# EAGLE design eib-128 (EAGLE 6.5.0)
DESIGNER: JONNEW, MWL@MIT; DESIGN_NAME: eib-128 (2x64_hirose-circular); LICENSE: (c) Jon Newman CC-BY-SA-NC 4.0; REVISION: 1.1
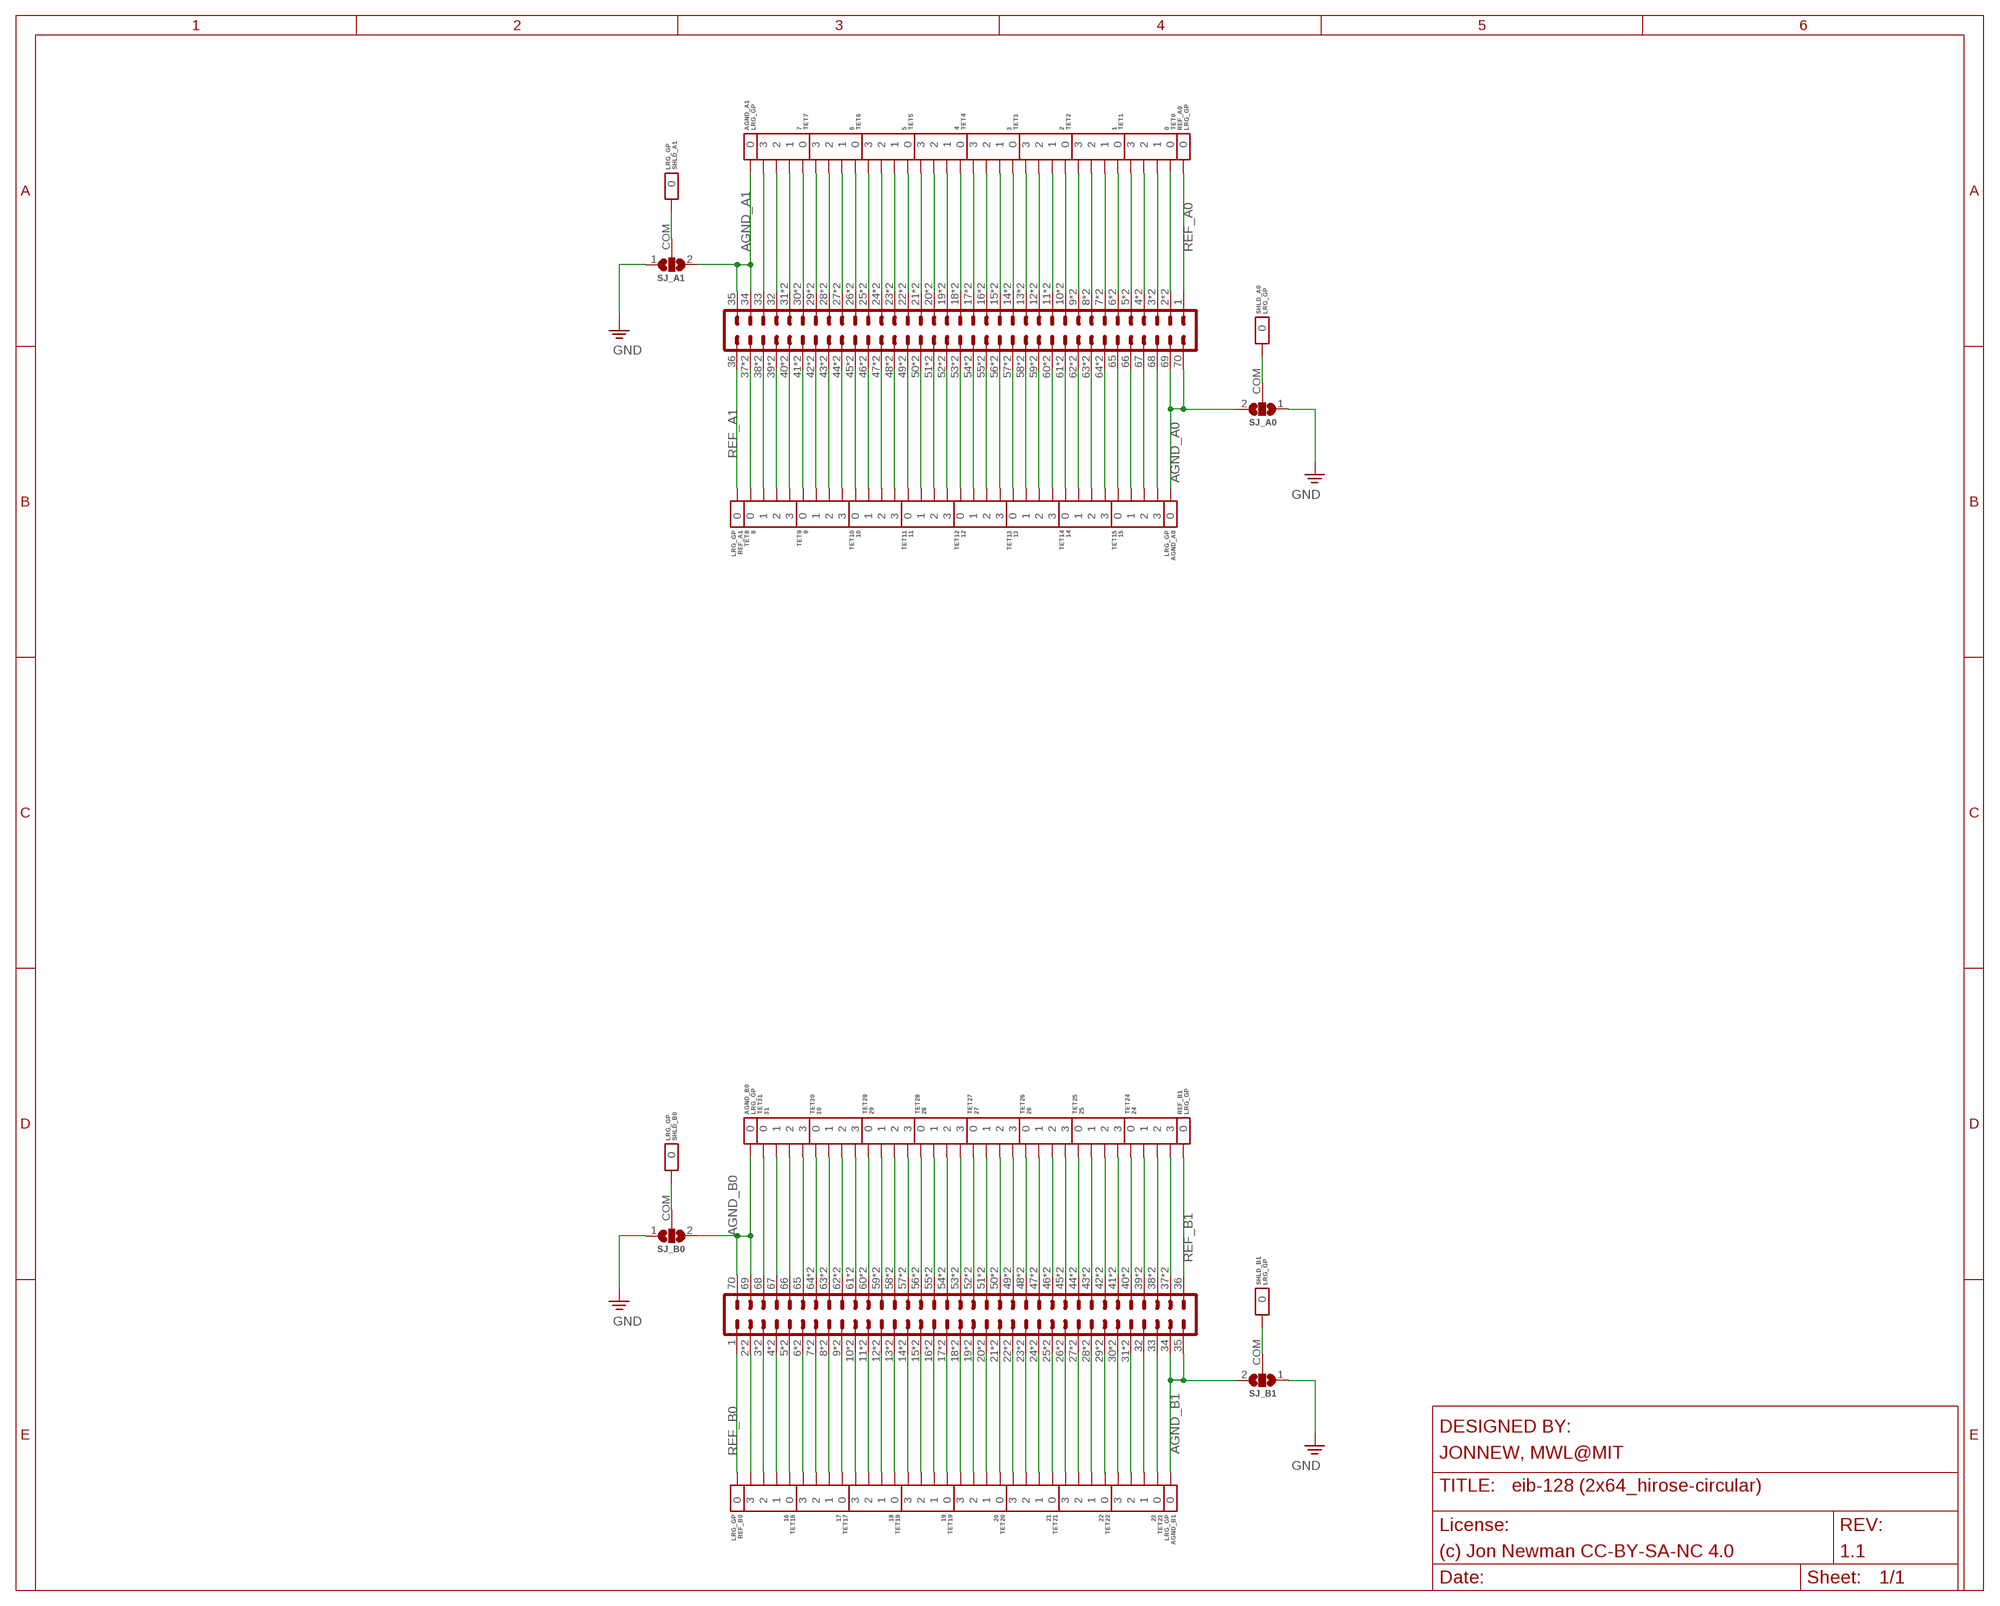
[diagram p0: schematic, sheet 1]

## Parts
AGND_A0  LRG_GP  GOLDPIN_0.5ID_0.7OD  [GOLDPIN_0.5ID_0.7OD]
AGND_A1  LRG_GP  GOLDPIN_0.5ID_0.7OD  [GOLDPIN_0.5ID_0.7OD]
AGND_B0  LRG_GP  GOLDPIN_0.5ID_0.7OD  [GOLDPIN_0.5ID_0.7OD]
AGND_B1  LRG_GP  GOLDPIN_0.5ID_0.7OD  [GOLDPIN_0.5ID_0.7OD]
AIN_N0T  DF40HEAD  PINHD-2X35_DF40HEAD-EIB  [DF40-70HEAD-EIB]
AIN_S0T  DF40HEAD  PINHD-2X35_DF40HEAD-EIB  [DF40-70HEAD-EIB]
REF_A0  LRG_GP  GOLDPIN_0.5ID_0.7OD  [GOLDPIN_0.5ID_0.7OD]
REF_A1  LRG_GP  GOLDPIN_0.5ID_0.7OD  [GOLDPIN_0.5ID_0.7OD]
REF_B0  LRG_GP  GOLDPIN_0.5ID_0.7OD  [GOLDPIN_0.5ID_0.7OD]
REF_B1  LRG_GP  GOLDPIN_0.5ID_0.7OD  [GOLDPIN_0.5ID_0.7OD]
SHLD_A0  LRG_GP  GOLDPIN_0.5ID_0.7OD  [GOLDPIN_0.5ID_0.7OD]
SHLD_A1  LRG_GP  GOLDPIN_0.5ID_0.7OD  [GOLDPIN_0.5ID_0.7OD]
SHLD_B0  LRG_GP  GOLDPIN_0.5ID_0.7OD  [GOLDPIN_0.5ID_0.7OD]
SHLD_B1  LRG_GP  GOLDPIN_0.5ID_0.7OD  [GOLDPIN_0.5ID_0.7OD]
SJ_A0  SJ2_0402  [SJ_2_0402]
SJ_A1  SJ2_0402  [SJ_2_0402]
SJ_B0  SJ2_0402  [SJ_2_0402]
SJ_B1  SJ2_0402  [SJ_2_0402]
TET0  0  TETRODE_128_0.5ID_0.7OD  [TETRODE_128_0.5ID_0.7OD]
TET1  1  TETRODE_128_0.5ID_0.7OD  [TETRODE_128_0.5ID_0.7OD]
TET2  2  TETRODE_128_0.5ID_0.7OD  [TETRODE_128_0.5ID_0.7OD]
TET3  3  TETRODE_128_0.5ID_0.7OD  [TETRODE_128_0.5ID_0.7OD]
TET4  4  TETRODE_128_0.5ID_0.7OD  [TETRODE_128_0.5ID_0.7OD]
TET5  5  TETRODE_128_0.5ID_0.7OD  [TETRODE_128_0.5ID_0.7OD]
TET6  6  TETRODE_128_0.5ID_0.7OD  [TETRODE_128_0.5ID_0.7OD]
TET7  7  TETRODE_128_0.5ID_0.7OD  [TETRODE_128_0.5ID_0.7OD]
TET8  8  TETRODE_128_0.5ID_0.7OD  [TETRODE_128_0.5ID_0.7OD]
TET9  9  TETRODE_128_0.5ID_0.7OD  [TETRODE_128_0.5ID_0.7OD]
TET10  10  TETRODE_128_0.5ID_0.7OD  [TETRODE_128_0.5ID_0.7OD]
TET11  11  TETRODE_128_0.5ID_0.7OD  [TETRODE_128_0.5ID_0.7OD]
TET12  12  TETRODE_128_0.5ID_0.7OD  [TETRODE_128_0.5ID_0.7OD]
TET13  13  TETRODE_128_0.5ID_0.7OD  [TETRODE_128_0.5ID_0.7OD]
TET14  14  TETRODE_128_0.5ID_0.7OD  [TETRODE_128_0.5ID_0.7OD]
TET15  15  TETRODE_128_0.5ID_0.7OD  [TETRODE_128_0.5ID_0.7OD]
TET16  16  TETRODE_128_0.5ID_0.7OD  [TETRODE_128_0.5ID_0.7OD]
TET17  17  TETRODE_128_0.5ID_0.7OD  [TETRODE_128_0.5ID_0.7OD]
TET18  18  TETRODE_128_0.5ID_0.7OD  [TETRODE_128_0.5ID_0.7OD]
TET19  19  TETRODE_128_0.5ID_0.7OD  [TETRODE_128_0.5ID_0.7OD]
TET20  20  TETRODE_128_0.5ID_0.7OD  [TETRODE_128_0.5ID_0.7OD]
TET21  21  TETRODE_128_0.5ID_0.7OD  [TETRODE_128_0.5ID_0.7OD]
TET22  22  TETRODE_128_0.5ID_0.7OD  [TETRODE_128_0.5ID_0.7OD]
TET23  23  TETRODE_128_0.5ID_0.7OD  [TETRODE_128_0.5ID_0.7OD]
TET24  24  TETRODE_128_0.5ID_0.7OD  [TETRODE_128_0.5ID_0.7OD]
TET25  25  TETRODE_128_0.5ID_0.7OD  [TETRODE_128_0.5ID_0.7OD]
TET26  26  TETRODE_128_0.5ID_0.7OD  [TETRODE_128_0.5ID_0.7OD]
TET27  27  TETRODE_128_0.5ID_0.7OD  [TETRODE_128_0.5ID_0.7OD]
TET28  28  TETRODE_128_0.5ID_0.7OD  [TETRODE_128_0.5ID_0.7OD]
TET29  29  TETRODE_128_0.5ID_0.7OD  [TETRODE_128_0.5ID_0.7OD]
TET30  30  TETRODE_128_0.5ID_0.7OD  [TETRODE_128_0.5ID_0.7OD]
TET31  31  TETRODE_128_0.5ID_0.7OD  [TETRODE_128_0.5ID_0.7OD]

## Nets
AGND_A0: AGND_A0.P$1 AIN_N0T.69 AIN_N0T.70 SJ_A0.2
AGND_A1: AGND_A1.P$1 AIN_N0T.34 AIN_N0T.35 SJ_A1.2
AGND_B0: AGND_B0.P$1 AIN_S0T.69 AIN_S0T.70 SJ_B0.2
AGND_B1: AGND_B1.P$1 AIN_S0T.34 AIN_S0T.35 SJ_B1.2
GND: SJ_A0.1 SJ_A1.1 SJ_B0.1 SJ_B1.1
N$1: SHLD_A0.P$1 SJ_A0.COM
N$2: SHLD_A1.P$1 SJ_A1.COM
N$3: SHLD_B0.P$1 SJ_B0.COM
N$4: SHLD_B1.P$1 SJ_B1.COM
N$65: AIN_S0T.33 TET23.0
N$66: AIN_S0T.32 TET23.1
N$67: AIN_S0T.31 AIN_S0T.P31 TET23.2
N$68: AIN_S0T.30 AIN_S0T.P30 TET23.3
N$69: AIN_S0T.29 AIN_S0T.P29 TET22.0
N$70: AIN_S0T.28 AIN_S0T.P28 TET22.1
N$71: AIN_S0T.27 AIN_S0T.P27 TET22.2
N$72: AIN_S0T.26 AIN_S0T.P26 TET22.3
N$73: AIN_S0T.25 AIN_S0T.P25 TET21.0
N$74: AIN_S0T.24 AIN_S0T.P24 TET21.1
N$75: AIN_S0T.23 AIN_S0T.P23 TET21.2
N$76: AIN_S0T.22 AIN_S0T.P22 TET21.3
N$77: AIN_S0T.21 AIN_S0T.P21 TET20.0
N$78: AIN_S0T.20 AIN_S0T.P20 TET20.1
N$79: AIN_S0T.19 AIN_S0T.P19 TET20.2
N$80: AIN_S0T.18 AIN_S0T.P18 TET20.3
N$81: AIN_S0T.17 AIN_S0T.P17 TET19.0
N$82: AIN_S0T.16 AIN_S0T.P16 TET19.1
N$83: AIN_S0T.15 AIN_S0T.P15 TET19.2
N$84: AIN_S0T.14 AIN_S0T.P14 TET19.3
N$85: AIN_S0T.13 AIN_S0T.P13 TET18.0
N$86: AIN_S0T.12 AIN_S0T.P12 TET18.1
N$87: AIN_S0T.11 AIN_S0T.P11 TET18.2
N$88: AIN_S0T.10 AIN_S0T.P10 TET18.3
N$89: AIN_S0T.9 AIN_S0T.P9 TET17.0
N$90: AIN_S0T.8 AIN_S0T.P8 TET17.1
N$91: AIN_S0T.7 AIN_S0T.P7 TET17.2
N$92: AIN_S0T.6 AIN_S0T.P6 TET17.3
N$93: AIN_S0T.5 AIN_S0T.P5 TET16.0
N$94: AIN_S0T.4 AIN_S0T.P4 TET16.1
N$95: AIN_S0T.3 AIN_S0T.P3 TET16.2
N$96: AIN_S0T.38 AIN_S0T.P38 TET24.2
N$97: AIN_S0T.39 AIN_S0T.P39 TET24.1
N$98: AIN_S0T.40 AIN_S0T.P40 TET24.0
N$99: AIN_S0T.41 AIN_S0T.P41 TET25.3
N$100: AIN_S0T.42 AIN_S0T.P42 TET25.2
N$101: AIN_S0T.43 AIN_S0T.P43 TET25.1
N$102: AIN_S0T.44 AIN_S0T.P44 TET25.0
N$103: AIN_S0T.45 AIN_S0T.P45 TET26.3
N$104: AIN_S0T.46 AIN_S0T.P46 TET26.2
N$105: AIN_S0T.47 AIN_S0T.P47 TET26.1
N$106: AIN_S0T.48 AIN_S0T.P48 TET26.0
N$107: AIN_S0T.49 AIN_S0T.P49 TET27.3
N$108: AIN_S0T.50 AIN_S0T.P50 TET27.2
N$109: AIN_S0T.51 AIN_S0T.P51 TET27.1
N$110: AIN_S0T.52 AIN_S0T.P52 TET27.0
N$111: AIN_S0T.53 AIN_S0T.P53 TET28.3
N$112: AIN_S0T.54 AIN_S0T.P54 TET28.2
N$113: AIN_S0T.55 AIN_S0T.P55 TET28.1
N$114: AIN_S0T.56 AIN_S0T.P56 TET28.0
N$115: AIN_S0T.57 AIN_S0T.P57 TET29.3
N$116: AIN_S0T.58 AIN_S0T.P58 TET29.2
N$117: AIN_S0T.59 AIN_S0T.P59 TET29.1
N$118: AIN_S0T.60 AIN_S0T.P60 TET29.0
N$119: AIN_S0T.61 AIN_S0T.P61 TET30.3
N$120: AIN_S0T.62 AIN_S0T.P62 TET30.2
N$121: AIN_S0T.63 AIN_S0T.P63 TET30.1
N$122: AIN_S0T.64 AIN_S0T.P64 TET30.0
N$123: AIN_S0T.65 TET31.3
N$124: AIN_S0T.66 TET31.2
N$125: AIN_S0T.67 TET31.1
N$126: AIN_S0T.68 TET31.0
N$127: AIN_S0T.2 AIN_S0T.P2 TET16.3
N$128: AIN_S0T.37 AIN_S0T.P37 TET24.3
N$199: AIN_N0T.33 TET7.3
N$200: AIN_N0T.32 TET7.2
N$201: AIN_N0T.31 AIN_N0T.P31 TET7.1
N$202: AIN_N0T.30 AIN_N0T.P30 TET7.0
N$203: AIN_N0T.29 AIN_N0T.P29 TET6.3
N$204: AIN_N0T.28 AIN_N0T.P28 TET6.2
N$205: AIN_N0T.27 AIN_N0T.P27 TET6.1
N$206: AIN_N0T.26 AIN_N0T.P26 TET6.0
N$207: AIN_N0T.25 AIN_N0T.P25 TET5.3
N$208: AIN_N0T.24 AIN_N0T.P24 TET5.2
N$209: AIN_N0T.23 AIN_N0T.P23 TET5.1
N$210: AIN_N0T.22 AIN_N0T.P22 TET5.0
N$211: AIN_N0T.21 AIN_N0T.P21 TET4.3
N$212: AIN_N0T.20 AIN_N0T.P20 TET4.2
N$213: AIN_N0T.19 AIN_N0T.P19 TET4.1
N$214: AIN_N0T.18 AIN_N0T.P18 TET4.0
N$215: AIN_N0T.17 AIN_N0T.P17 TET3.3
N$216: AIN_N0T.16 AIN_N0T.P16 TET3.2
N$217: AIN_N0T.15 AIN_N0T.P15 TET3.1
N$218: AIN_N0T.14 AIN_N0T.P14 TET3.0
N$219: AIN_N0T.13 AIN_N0T.P13 TET2.3
N$220: AIN_N0T.12 AIN_N0T.P12 TET2.2
N$221: AIN_N0T.11 AIN_N0T.P11 TET2.1
N$222: AIN_N0T.10 AIN_N0T.P10 TET2.0
N$223: AIN_N0T.9 AIN_N0T.P9 TET1.3
N$224: AIN_N0T.8 AIN_N0T.P8 TET1.2
N$225: AIN_N0T.7 AIN_N0T.P7 TET1.1
N$226: AIN_N0T.6 AIN_N0T.P6 TET1.0
N$227: AIN_N0T.5 AIN_N0T.P5 TET0.3
N$228: AIN_N0T.4 AIN_N0T.P4 TET0.2
N$229: AIN_N0T.3 AIN_N0T.P3 TET0.1
N$230: AIN_N0T.2 AIN_N0T.P2 TET0.0
N$231: AIN_N0T.38 AIN_N0T.P38 TET8.1
N$232: AIN_N0T.39 AIN_N0T.P39 TET8.2
N$233: AIN_N0T.40 AIN_N0T.P40 TET8.3
N$234: AIN_N0T.41 AIN_N0T.P41 TET9.0
N$235: AIN_N0T.42 AIN_N0T.P42 TET9.1
N$236: AIN_N0T.43 AIN_N0T.P43 TET9.2
N$237: AIN_N0T.44 AIN_N0T.P44 TET9.3
N$238: AIN_N0T.45 AIN_N0T.P45 TET10.0
N$239: AIN_N0T.46 AIN_N0T.P46 TET10.1
N$240: AIN_N0T.47 AIN_N0T.P47 TET10.2
N$241: AIN_N0T.48 AIN_N0T.P48 TET10.3
N$242: AIN_N0T.49 AIN_N0T.P49 TET11.0
N$243: AIN_N0T.50 AIN_N0T.P50 TET11.1
N$244: AIN_N0T.51 AIN_N0T.P51 TET11.2
N$245: AIN_N0T.52 AIN_N0T.P52 TET11.3
N$246: AIN_N0T.53 AIN_N0T.P53 TET12.0
N$247: AIN_N0T.54 AIN_N0T.P54 TET12.1
N$248: AIN_N0T.55 AIN_N0T.P55 TET12.2
N$249: AIN_N0T.56 AIN_N0T.P56 TET12.3
N$250: AIN_N0T.57 AIN_N0T.P57 TET13.0
N$251: AIN_N0T.58 AIN_N0T.P58 TET13.1
N$252: AIN_N0T.59 AIN_N0T.P59 TET13.2
N$253: AIN_N0T.60 AIN_N0T.P60 TET13.3
N$254: AIN_N0T.61 AIN_N0T.P61 TET14.0
N$255: AIN_N0T.62 AIN_N0T.P62 TET14.1
N$256: AIN_N0T.63 AIN_N0T.P63 TET14.2
N$257: AIN_N0T.64 AIN_N0T.P64 TET14.3
N$258: AIN_N0T.65 TET15.0
N$259: AIN_N0T.66 TET15.1
N$260: AIN_N0T.67 TET15.2
N$261: AIN_N0T.68 TET15.3
N$1000: AIN_N0T.37 AIN_N0T.P37 TET8.0
REF_A0: AIN_N0T.1 REF_A0.P$1
REF_A1: AIN_N0T.36 REF_A1.P$1
REF_B0: AIN_S0T.1 REF_B0.P$1
REF_B1: AIN_S0T.36 REF_B1.P$1

## Library data of the parts
AGND_A0 AGND_A1 AGND_B0 AGND_B1 REF_A0 REF_A1 REF_B0 REF_B1 SHLD_A0 SHLD_A1 SHLD_B0 SHLD_B1 = jonnew:GOLDPIN
AIN_N0T AIN_S0T = jonnew:PINHD-2X35
SJ_A0 SJ_A1 SJ_B0 SJ_B1 = jonnew:SJ2: SMD solder JUMPER
TET0 TET1-TET31 = jonnew:TETRODE

## Net classes
1 thick: width 0.102 mm

## Board
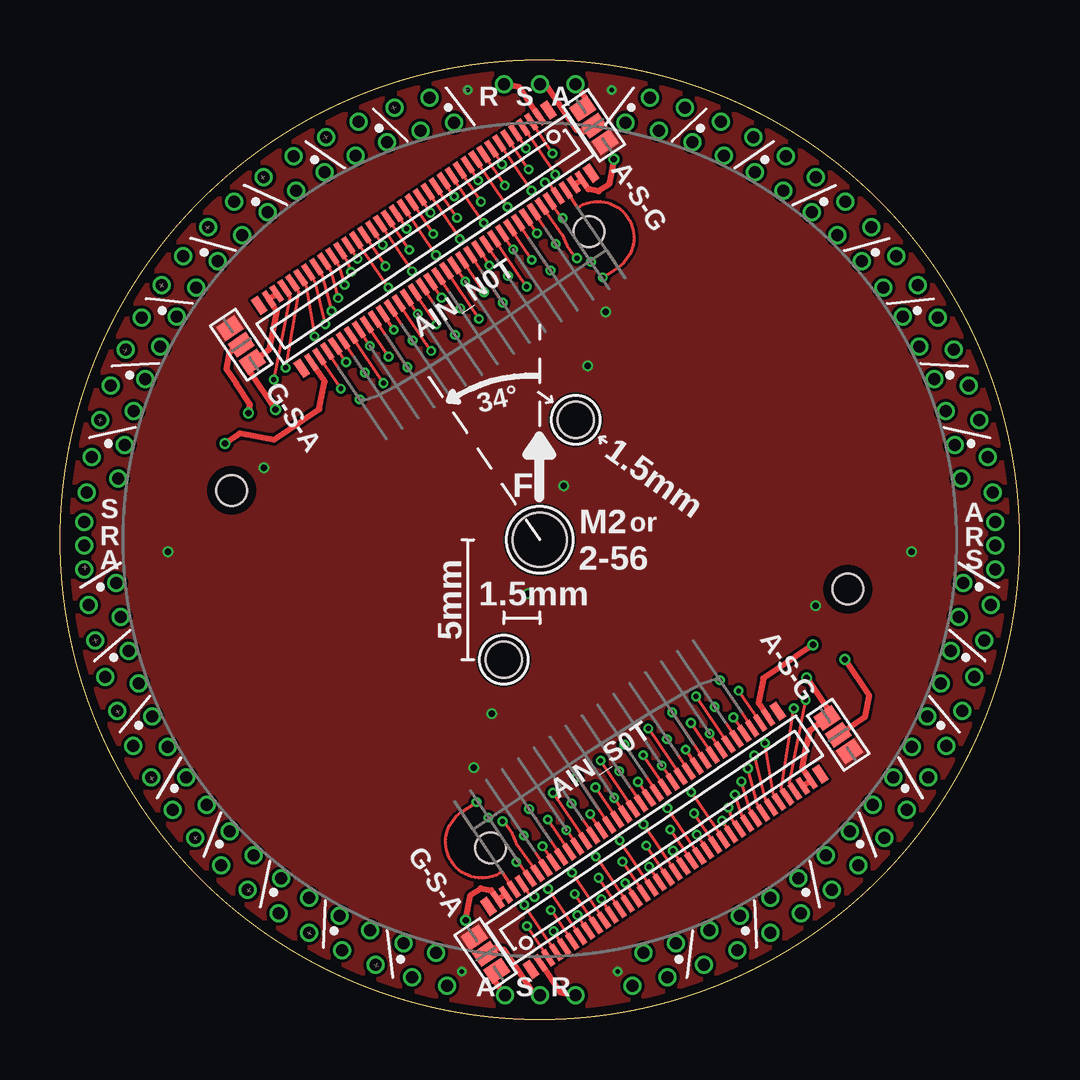
[diagram p1: board, top side]
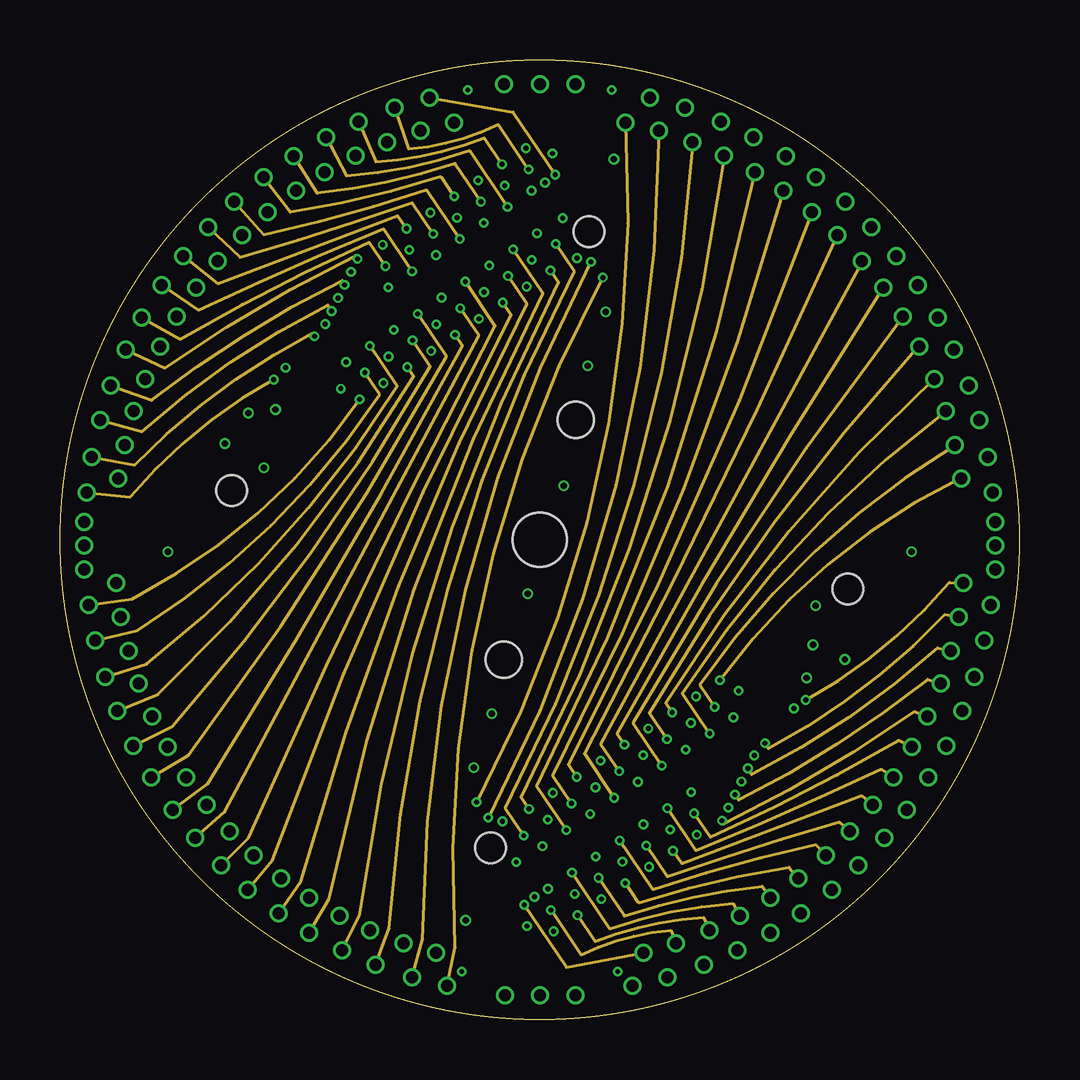
[diagram p2: board, inner layer Route2]
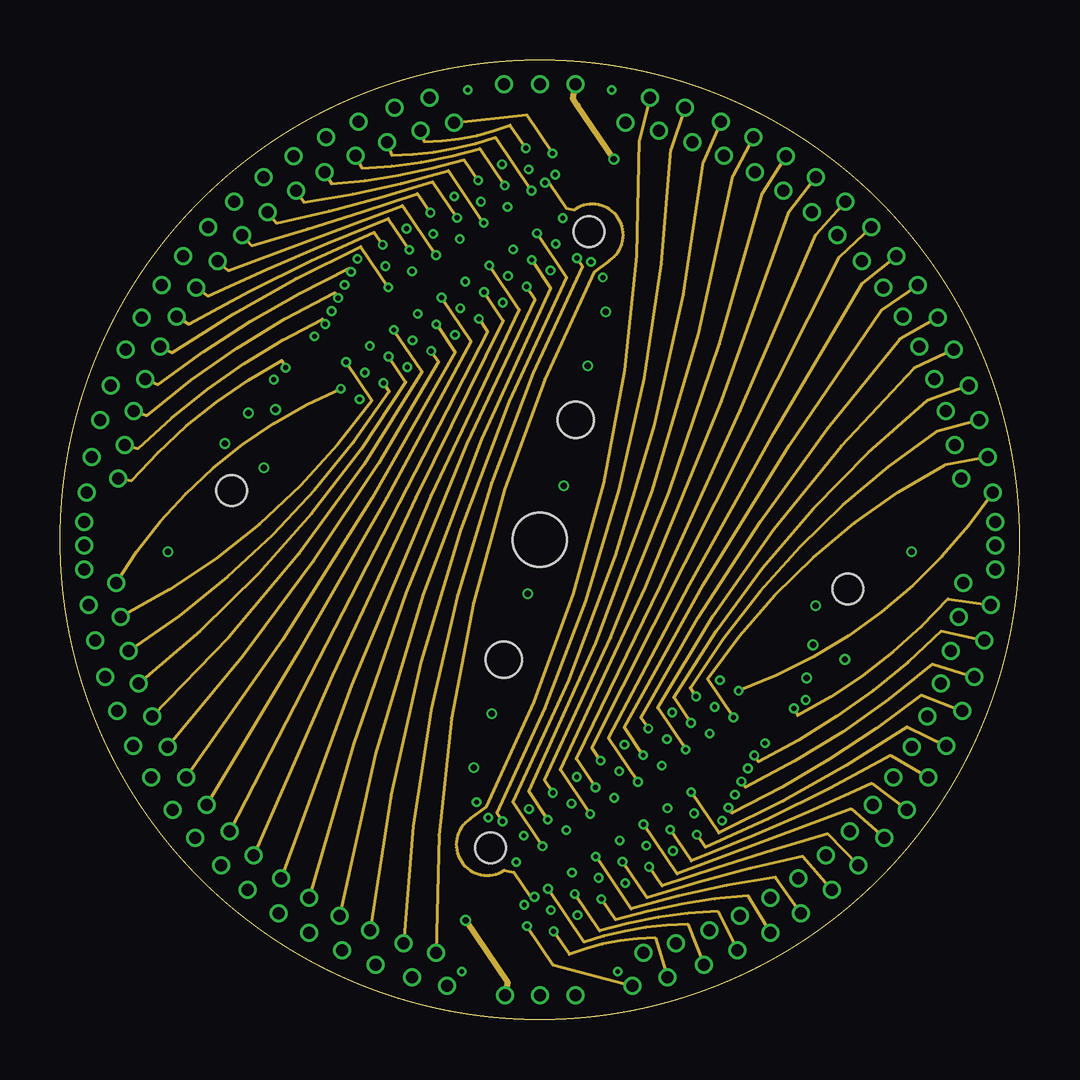
[diagram p3: board, inner layer Route15]
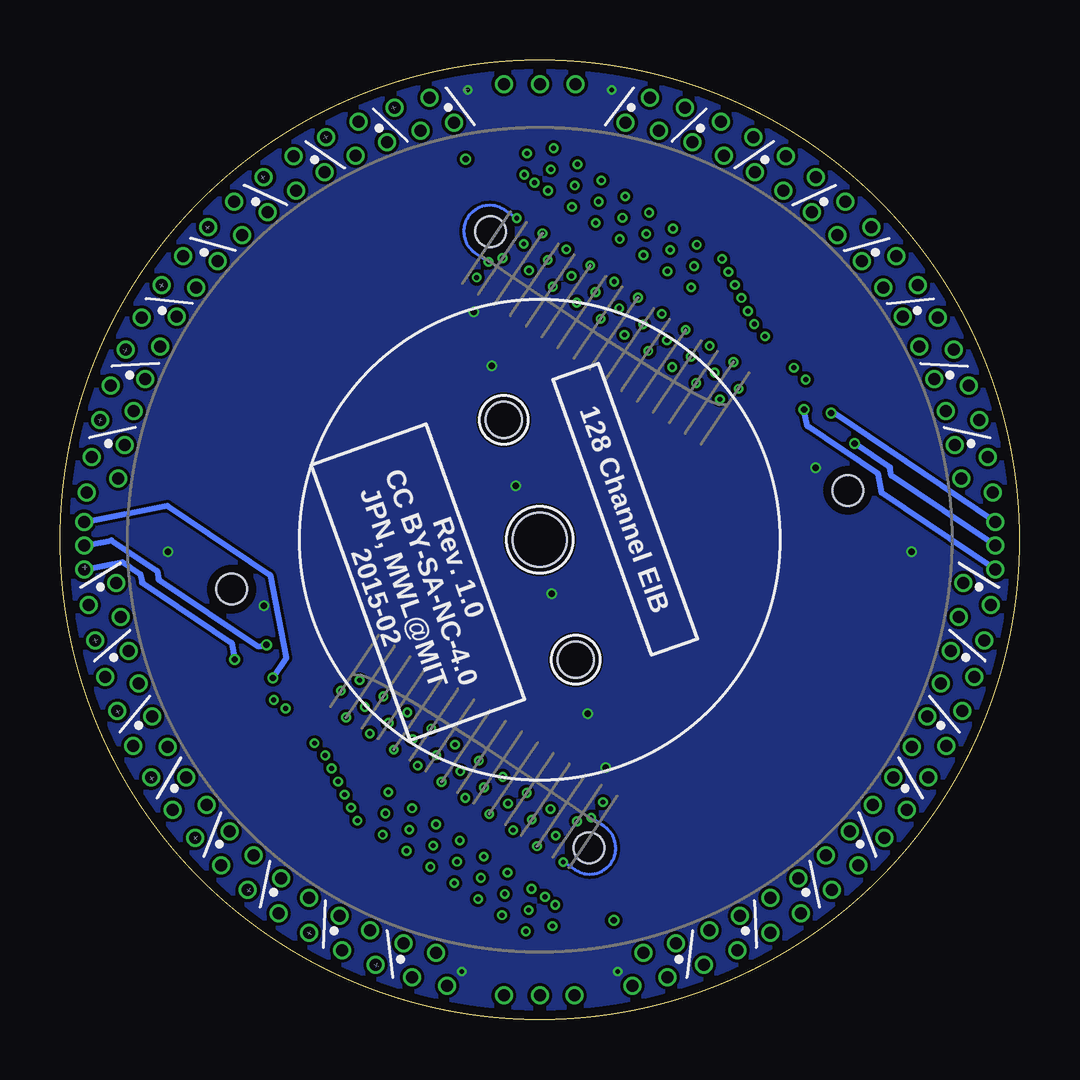
[diagram p4: board, bottom side, seen from below]

Size 40 x 40 mm. Coordinates in mm from the lower left corner, seen from the top.
Outline: circle at 20,20 radius 20
Outline: circle at 20,20 radius 20
Copper layers (1*2*15*16): Top 0.035559375mm / dielectric 0.17018125mm / Route2 0.01778125mm / dielectric 47mil / Route15 0.01778125mm / dielectric 0.17018125mm / Bottom 0.035559375mm
Design rules "sierra-circuits-advanced *": minimum track width 5mil, minimum drill 0.000196875mm, track to track 5mil, track to pad 5mil, pad to pad 5mil, via to via 5mil, smd to smd 5mil, copper to edge 15mil, drill to drill 5mil, minimum pad ring 4mil, minimum via ring 4mil, stop-mask expansion 4mil, vias tented up to drill 100mil, thermal gap 10mil
Holes 1.27 mm at 22.06,32.85 32.85,17.94 17.94,7.15 7.15,22.06

### Footprints (pad centres in the part's own frame; a part is rotated, then mirrored left to right if it is on the bottom)
GOLDPIN_0.5ID_0.7OD = drill 0.5 pad 0.7: P$1 0,0
DF40-70HEAD-EIB = smd 0.23 x 0.75: 1 -6.8,-1.585; 2 -6.4,-1.585; 3 -6,-1.585; 4 -5.6,-1.585; 5 -5.2,-1.585; 6 -4.8,-1.585; 7 -4.4,-1.585; 8 -4,-1.585; 9 -3.6,-1.585; 10 -3.2,-1.585; 11 -2.8,-1.585; 12 -2.4,-1.585; 13 -2,-1.585; 14 -1.6,-1.585; 15 -1.2,-1.585; 16 -0.8,-1.585; 17 -0.4,-1.585; 18 0,-1.585; 19 0.4,-1.585; 20 0.8,-1.585; 21 1.2,-1.585; 22 1.6,-1.585; 23 2,-1.585; 24 2.4,-1.585; 25 2.8,-1.585; 26 3.2,-1.585; 27 3.6,-1.585; 28 4,-1.585; 29 4.4,-1.585; 30 4.8,-1.585; 31 5.2,-1.585; 32 5.6,-1.585; 33 6,-1.585; 34 6.4,-1.585; 35 6.8,-1.585; 36 6.8,1.585; 37 6.4,1.585; 38 6,1.585; 39 5.6,1.585; 40 5.2,1.585; 41 4.8,1.585; 42 4.4,1.585; 43 4,1.585; 44 3.6,1.585; 45 3.2,1.585; 46 2.8,1.585; 47 2.4,1.585; 48 2,1.585; 49 1.6,1.585; 50 1.2,1.585; 51 0.8,1.585; 52 0.4,1.585; 53 0,1.585; 54 -0.4,1.585; 55 -0.8,1.585; 56 -1.2,1.585; 57 -1.6,1.585; 58 -2,1.585; 59 -2.4,1.585; 60 -2.8,1.585; 61 -3.2,1.585; 62 -3.6,1.585; 63 -4,1.585; 64 -4.4,1.585; 65 -4.8,1.585; 66 -5.2,1.585; 67 -5.6,1.585; 68 -6,1.585; 69 -6.4,1.585; 70 -6.8,1.585 | smd 0.35 x 0.75: M1 -7.275,-1.585; M2 7.275,-1.585; M3 7.275,1.585; M4 -7.275,1.585 | drill 0.2 pad 0.305: P2 -6.4,0; P3 -6,0.8; P4 -5.6,-0.8; P5 -5.2,0; P6 -4.8,0.8; P7 -4.4,-0.8; P8 -4,0; P9 -3.6,0.8; P10 -3.2,-0.8; P11 -2.8,0; P12 -2.4,0.8; P13 -2,-0.8; P14 -1.6,0; P15 -1.2,0.8; P16 -0.8,-0.8; P17 -0.4,0; P18 0,0.8; P19 0.4,-0.8; P20 0.8,0; P21 1.2,0.8; P22 1.6,-0.8; P23 2,0; P24 2.4,0.8; P25 2.8,-0.9; P26 3.327,-0.6; P27 3.854,-0.3; P28 4.381,0; P29 4.908,0.3; P30 5.435,0.6; P31 6.089,0.773; P37 6.4,3.2; P38 6,4; P39 5.6,2.4; P40 5.2,3.2; P41 4.8,4; P42 4.4,2.4; P43 4,3.2; P44 3.6,4; P45 3.2,2.4; P46 2.8,3.2; P47 2.4,4; P48 2,2.4; P49 1.6,3.2; P50 1.2,4; P51 0.8,2.4; P52 0.4,3.2; P53 0,4; P54 -0.4,2.4; P55 -0.8,3.2; P56 -1.2,4; P57 -1.6,2.4; P58 -2,3.2; P59 -2.4,4; P60 -2.8,2.4; P61 -3.2,3.2; P62 -3.6,4; P63 -4,2.4; P64 -4.4,3.2
SJ_2_0402 = smd 0.7 x 0.9: 1 -0.838,0; 2 0.838,0; COM 0,0
TETRODE_128_0.5ID_0.7OD = drill 0.5 pad 0.703: 0 0.724,17.743; 1 1.562,18.934; 2 2.14,17.628; 3 3.058,18.748
EIB_MOUNT_A = hole 2.261: 0,0 | hole 1.5: 1.5,5; -1.5,-5

### Placement (x,y rotation side)
AGND_A0  21.5,39 0 top
AGND_A1  1,18.75 0 top
AGND_B0  18.55,1 34 top
AGND_B1  39,20.75 34 top
AIN_N0T  15.23,32.53 214 top
AIN_S0T  24.77,7.47 34 top
REF_A0  18.5,39 0 top
REF_A1  1,19.75 0 top
REF_B0  21.5,1 34 top
REF_B1  39,19.75 34 top
SHLD_A0  20,39 0 top
SHLD_A1  1,20.75 0 top
SHLD_B0  20,1 34 top
SHLD_B1  39,18.75 34 top
SJ_A0  22.26,37.27 124 top
SJ_A1  7.55,28.13 304 top
SJ_B0  17.74,2.73 304 top
SJ_B1  32.45,11.87 124 top
TET0  20,20 350.7 bottom
TET1  20,20 341.3 bottom
TET2  20,20 332 bottom
TET3  20,20 322.6 bottom
TET4  20,20 313.2 bottom
TET5  20,20 303.9 bottom
TET6  20,20 294.5 bottom
TET7  20,20 285.2 bottom
TET8  20,20 266.5 bottom
TET9  20,20 257.2 bottom
TET10  20,20 247.8 bottom
TET11  20,20 238.4 bottom
TET12  20,20 229.1 bottom
TET13  20,20 219.7 bottom
TET14  20,20 210.4 bottom
TET15  20,20 201 bottom
TET16  20,20 201 top
TET17  20,20 210.4 top
TET18  20,20 219.7 top
TET19  20,20 229.1 top
TET20  20,20 238.4 top
TET21  20,20 247.8 top
TET22  20,20 257.2 top
TET23  20,20 266.5 top
TET24  20,20 285.2 top
TET25  20,20 294.5 top
TET26  20,20 303.9 top
TET27  20,20 313.2 top
TET28  20,20 322.6 top
TET29  20,20 332 top
TET30  20,20 341.3 top
TET31  20,20 350.7 top
U$1  [EIB_MOUNT_A]  20,20 0 top

### Tracks (layer width: path | path; a pad name or v marks a point on that pad's centre or on a via)
AGND_A0  (via drill 0.25)
  Top 0.254: AIN_N0T.69 AIN_N0T.70 22.02,34.61 22.46,34.53 22.88,34.81 v23.08,35.87 | AGND_A0.P$1 21.89,38.42 SJ_A0.2
  Route15 0.254: v23.08,35.87 21.58,38.1 21.38,38.39 AGND_A0.P$1
AGND_A1  (via drill 0.25)
  Top 0.254: AIN_N0T.34 AIN_N0T.35 9.04,29.53 8.74,27.95 SJ_A1.2 7.92,27.01 v8.98,25.43
  Bottom 0.254: AGND_A1.P$1 5.74,21.95 5.9,22.74 8.84,24.73 v8.98,25.43
AGND_B0  (via drill 0.25)
  Top 0.254: AIN_S0T.69 AIN_S0T.70 17.98,5.39 17.54,5.47 17.12,5.19 v16.92,4.13 | AGND_B0.P$1 18.12,1.64 SJ_B0.2
  Route15 0.254: v16.92,4.13 18.66,1.55 AGND_B0.P$1
AGND_B1  (via drill 0.25)
  Top 0.254: v31.12,14.24 32.05,12.86 SJ_B1.2 31.24,12.04 31.12,11.43 30.94,10.49 31.35,9.88 AIN_S0T.35 AIN_S0T.34
  Bottom 0.254: AGND_B1.P$1 35.52,21.43 31.24,18.54 30.57,15.07 v31.12,14.24
GND  (via drill 0.2 pad 0.3, 0.25 pad 0.3)
  other vias: 18,12.75 8.5,23 19.5,17.75 16.75,2 4.5,19.5 23.25,2 21,22.25 22,27.25 35.5,19.5 17,38.75 23,38.75 31.5,17.25 22.75,29.5 17.25,10.5
  pour Top (no thermals): 13.15,-15.26 -15.26,26.85 26.85,55.26 55.26,13.15
  pour Bottom (no thermals): 13.15,-15.26 -15.26,26.85 26.85,55.26 55.26,13.15
N$1
  Top 0.254: SJ_A0.COM 21.88,37.02 21.53,37.09 20.27,38.95 SHLD_A0.P$1
N$2  (via drill 0.25)
  Top 0.254: v7.85,25.29 7.92,25.64 7.36,26.48 | SJ_A1.COM 7.06,27.8 6.93,27.12 7.36,26.48 | 7.36,26.48
  Bottom 0.254: SHLD_A1.P$1 7.76,25.31 v7.85,25.29
N$3
  Top 0.254: SJ_B0.COM 18.12,2.98 18.51,2.91 19.76,1.05 SHLD_B0.P$1
N$4  (via drill 0.25)
  Top 0.254: SJ_B1.COM 33.57,12.63 33.74,13.49 v32.72,15.01
  Bottom 0.254: SHLD_B1.P$1 37.39,19.06 36.65,18.57 36.58,18.22 32.85,15.7 v32.72,15.01
N$65  (via drill 0.2 pad 0.3)
  Top 0.127: AIN_S0T.33 30.41,9.84 v31.09,13.32
  Route2 0.127: v31.09,13.32 arc21 37.08,18.22 TET23.0
N$66  (via drill 0.2 pad 0.3)
  Top 0.127: AIN_S0T.32 30.07,9.63 30.08,9.64 v30.59,12.97
  Route15 0.127: TET23.1 37.01,17.54 arc-21 30.75,12.67 v30.59,12.97
N$67
  Top 0.127: AIN_S0T.31 29.74,9.41 AIN_S0T.P31
  Route2 0.127: TET23.2 36.89,16.88 arc-18 29.54,11.3 29.53,11.3 AIN_S0T.P31
N$68
  Top 0.127: AIN_S0T.30 29.41,9.19 AIN_S0T.P30
  Route15 0.127: TET23.3 36.74,16.19 arc-18 29.12,10.75 AIN_S0T.P30
N$69
  Top 0.127: AIN_S0T.29 29.07,8.96 AIN_S0T.P29
  Route2 0.127: TET22.0 36.57,15.49 arc-15 28.84,10.21 28.84,10.22 AIN_S0T.P29
N$70
  Top 0.127: AIN_S0T.28 28.99,8.4 28.75,8.75 AIN_S0T.P28
  Route15 0.127: TET22.1 36.36,14.82 arc-15 28.56,9.69 AIN_S0T.P28
N$71
  Top 0.127: AIN_S0T.27 28.42,8.52 AIN_S0T.P27
  Route2 0.127: TET22.2 36.17,14.18 arc-12 28.3,9.15 28.29,9.15 AIN_S0T.P27
N$72
  Top 0.127: AIN_S0T.26 28.29,7.93 28.06,8.28 AIN_S0T.P26
  Route15 0.127: TET22.3 35.9,13.52 arc-12 28.02,8.61 AIN_S0T.P26
N$73
  Top 0.127: AIN_S0T.25 AIN_S0T.P25
  Route2 0.127: AIN_S0T.P25 27.69,8.15 27.69,8.15 arc9 35.61,12.84 TET21.0
N$74
  Top 0.127: AIN_S0T.24 AIN_S0T.P24
  Route15 0.127: AIN_S0T.P24 27.47,7.78 arc9 35.32,12.2 TET21.1
N$75
  Top 0.127: AIN_S0T.P23 AIN_S0T.23
  Route2 0.127: AIN_S0T.P23 27.11,7.6 arc6 34.99,11.63 TET21.2
N$76
  Top 0.127: AIN_S0T.22 AIN_S0T.P22
  Route15 0.127: AIN_S0T.P22 26.9,7.18 arc6 34.63,11.01 TET21.3
N$77
  Top 0.127: AIN_S0T.P21 AIN_S0T.21
  Route2 0.127: AIN_S0T.P21 26.52,7.04 arc3 34.25,10.42 TET20.0
N$78
  Top 0.127: AIN_S0T.20 AIN_S0T.P20
  Route15 0.127: AIN_S0T.P20 AIN_S0T.20 arc3 33.84,9.84 TET20.1
N$79
  Top 0.127: AIN_S0T.P19 AIN_S0T.19
  Route2 0.127: AIN_S0T.P19 25.92,6.49 33.44,9.32 TET20.2
N$80
  Top 0.127: AIN_S0T.18 AIN_S0T.P18
  Route15 0.127: AIN_S0T.P18 25.72,6.07 32.98,8.77 TET20.3
N$81
  Top 0.127: AIN_S0T.P17 AIN_S0T.17
  Route2 0.127: AIN_S0T.P17 25.32,5.95 arc-3 32.5,8.23 TET19.0
N$82
  Top 0.127: AIN_S0T.16 AIN_S0T.P16
  Route15 0.127: AIN_S0T.P16 25.09,5.56 arc-3 32.01,7.73 TET19.1
N$83
  Top 0.127: AIN_S0T.P15 AIN_S0T.15
  Route2 0.127: AIN_S0T.P15 24.72,5.41 arc-6 31.52,7.28 TET19.2
N$84
  Top 0.127: AIN_S0T.14 AIN_S0T.P14
  Route15 0.127: AIN_S0T.P14 24.46,5.07 arc-6 30.97,6.79 TET19.3
N$85
  Top 0.127: AIN_S0T.P13 AIN_S0T.13
  Route2 0.127: AIN_S0T.P13 24.12,4.87 arc-9 30.39,6.35 TET18.0
N$86
  Top 0.127: AIN_S0T.12 AIN_S0T.P12
  Route15 0.127: AIN_S0T.P12 23.81,4.61 arc-9 29.83,5.93 TET18.1
N$87
  Top 0.127: AIN_S0T.P11 AIN_S0T.11
  Route2 0.127: AIN_S0T.P11 23.52,4.32 arc-12 29.27,5.56 TET18.2
N$88
  Top 0.127: AIN_S0T.P10 AIN_S0T.10
  Route15 0.127: AIN_S0T.P10 23.15,4.16 arc-12 28.69,5.17 TET18.3
N$89
  Top 0.127: AIN_S0T.9 AIN_S0T.P9
  Route2 0.127: AIN_S0T.P9 22.92,3.79 arc-15 28.05,4.84 TET17.0
N$90
  Top 0.127: AIN_S0T.P8 AIN_S0T.8
  Route15 0.127: AIN_S0T.P8 22.5,3.69 arc-15 27.42,4.51 TET17.1
N$91
  Top 0.127: AIN_S0T.P7 AIN_S0T.7
  Route2 0.127: AIN_S0T.P7 22.31,3.26 arc-18 26.83,4.25 TET17.2
N$92
  Top 0.127: AIN_S0T.6 AIN_S0T.P6
  Route15 0.127: AIN_S0T.P6 21.85,3.22 arc-18 26.17,3.97 TET17.3
N$93
  Top 0.127: AIN_S0T.5 AIN_S0T.P5
  Route2 0.127: AIN_S0T.P5 21.72,2.7 arc-21 25.46,3.72 TET16.0
N$94
  Top 0.127: AIN_S0T.P4 AIN_S0T.4
  Route15 0.127: AIN_S0T.P4 21.23,2.71 arc-21 24.82,3.4 TET16.1
N$95
  Top 0.127: AIN_S0T.P3 AIN_S0T.3
  Route2 0.127: AIN_S0T.P3 21.11,2.17 TET16.2
N$96
  Top 0.127: AIN_S0T.38 AIN_S0T.P38
  Route2 0.127: AIN_S0T.P38 arc-28 37.56,22.57 TET24.2
N$97
  Top 0.127: AIN_S0T.39 AIN_S0T.P39
  Route15 0.127: AIN_S0T.P39 arc90 AIN_S0T.P39 27,14.19 arc-28 36.89,23.12 TET24.1
N$98
  Top 0.127: AIN_S0T.40 AIN_S0T.P40
  Route2 0.127: AIN_S0T.P40 26.68,13.96 arc-24 37.31,23.93 TET24.0
N$99
  Top 0.127: AIN_S0T.41 AIN_S0T.P41
  Route15 0.127: AIN_S0T.P41 arc-90 AIN_S0T.P41 26.27,13.83 arc-24 36.56,24.52 TET25.3
N$100
  Top 0.127: AIN_S0T.42 AIN_S0T.P42
  Route2 0.127: AIN_S0T.P42 25.94,13.6 arc-20 36.91,25.35 TET25.2
N$101
  Top 0.127: AIN_S0T.43 AIN_S0T.P43
  Route15 0.127: AIN_S0T.P43 arc90 AIN_S0T.P43 25.59,13.42 arc-20 36.15,25.81 TET25.1
N$102
  Top 0.127: AIN_S0T.44 AIN_S0T.P44
  Route2 0.127: AIN_S0T.P44 25.26,13.19 arc-16 36.45,26.71 TET25.0
N$103
  Top 0.127: AIN_S0T.45 AIN_S0T.P45
  Route15 0.127: TET26.3 35.61,27.16 arc16 24.92,13 24.92,12.98 AIN_S0T.P45
N$104
  Top 0.127: AIN_S0T.46 AIN_S0T.P46
  Route2 0.127: AIN_S0T.P46 24.57,12.79 arc-12 35.79,28.06 TET26.2
N$105
  Top 0.127: AIN_S0T.47 AIN_S0T.P47
  Route15 0.127: AIN_S0T.P47 arc-90 AIN_S0T.P47 24.22,12.58 arc-12 35,28.37 TET26.1
N$106
  Top 0.127: AIN_S0T.48 AIN_S0T.P48
  Route2 0.127: AIN_S0T.P48 23.89,12.36 arc-8 35.13,29.28 TET26.0
N$107
  Top 0.127: AIN_S0T.49 AIN_S0T.P49
  Route15 0.127: AIN_S0T.P49 arc90 AIN_S0T.P49 | AIN_S0T.P49 23.53,12.18 arc-8 34.25,29.58 TET27.3
N$108
  Top 0.127: AIN_S0T.50 AIN_S0T.P50
  Route2 0.127: AIN_S0T.P50 23.23,11.92 arc-4 34.31,30.5 TET27.2
N$109
  Top 0.127: AIN_S0T.51 AIN_S0T.P51
  Route15 0.127: AIN_S0T.P51 arc-90 AIN_S0T.P51 22.87,11.72 arc-4 33.44,30.69 TET27.1
N$110
  Top 0.127: AIN_S0T.52 AIN_S0T.P52
  Route2 0.127: AIN_S0T.P52 22.54,11.49 TET27.0
N$111
  Top 0.127: AIN_S0T.53 AIN_S0T.P53
  Route15 0.127: AIN_S0T.P53 arc90 AIN_S0T.P53 22.18,11.31 32.48,31.79 TET28.3
N$112
  Top 0.127: AIN_S0T.54 AIN_S0T.P54
  Route2 0.127: AIN_S0T.P54 21.85,11.09 arc4 32.4,32.72 TET28.2
N$113
  Top 0.127: AIN_S0T.55 AIN_S0T.P55
  Route15 0.127: AIN_S0T.P55 arc-90 AIN_S0T.P55 21.52,10.86 arc4 31.51,32.73 TET28.1
N$114
  Top 0.127: AIN_S0T.56 AIN_S0T.P56
  Route2 0.127: AIN_S0T.P56 21.19,10.63 arc8 31.34,33.66 TET28.0
N$115
  Top 0.127: AIN_S0T.P57 22.16,8.47 AIN_S0T.57
  Route15 0.127: AIN_S0T.P57 arc-90 22.1,8.57 20.86,10.4 arc8 30.39,33.66 TET29.3
N$116
  Top 0.127: AIN_S0T.58 AIN_S0T.P58
  Route2 0.127: AIN_S0T.P58 20.53,10.17 arc12 30.17,34.55 TET29.2
N$117
  Top 0.127: AIN_S0T.59 AIN_S0T.P59
  Route15 0.127: AIN_S0T.P59 arc90 AIN_S0T.P59 20.2,9.97 arc12 29.28,34.44 TET29.1
N$118
  Top 0.127: AIN_S0T.60 AIN_S0T.P60
  Route2 0.127: AIN_S0T.P60 19.87,9.74 arc16 TET29.0
N$119
  Top 0.127: AIN_S0T.61 AIN_S0T.P61
  Route15 0.127: AIN_S0T.P61 arc90 AIN_S0T.P61 19.54,9.51 arc16 28.05,35.18 TET30.3
N$120
  Top 0.127: AIN_S0T.62 AIN_S0T.P62
  Route2 0.127: AIN_S0T.P62 19.21,9.28 arc20 27.7,36.01 TET30.2
N$121
  Top 0.127: AIN_S0T.63 AIN_S0T.P63
  Route15 0.127: AIN_S0T.P63 18.88,9.05 arc20 26.83,35.76 TET30.1
N$122
  Top 0.127: AIN_S0T.64 AIN_S0T.P64
  Route2 0.127: AIN_S0T.P64 18.55,8.82 arc24 26.38,36.59 TET30.0
N$123  (via drill 0.2 pad 0.3)
  Top 0.127: AIN_S0T.65 19.85,6.19 19.05,7.29 arc30 v18.45,8.26
  Route15 0.127: v18.45,8.26 arc-90 v18.45,8.26 18.22,8.6 arc24 25.47,36.28 TET31.3
N$124  (via drill 0.2 pad 0.3)
  Top 0.127: 19.51,5.96 AIN_S0T.66 19.13,6.54 v19.02,6.56
  Route2 0.127: TET31.2 24.97,37.03 arc-28 v17.86,8.42 v17.86,8.41
  Bottom 0.127: v19.02,6.56 18.52,6.24 arc-180 17.31,8.04 v17.86,8.41
N$125  (via drill 0.2 pad 0.3)
  Top 0.127: 19.2,5.74 AIN_S0T.67 19.21,5.73 19.6,5.15 v19.78,5.11
  Route15 0.127: 19.6,5.15 v19.78,5.11 19.59,5.15 18.92,6.14 18.51,6.22 arc-180 17.1,8.36 17.77,8.86 arc28 24.15,36.65 TET31.1
N$126  (via drill 0.2 pad 0.3)
  Top 0.127: AIN_S0T.68 18.42,6.16 18.43,6.16 arc-180 16.72,8.63 v17.36,9.06
  Route2 0.127: v17.36,9.06 arc32 TET31.0
N$127
  Top 0.127: AIN_S0T.2 AIN_S0T.P2
  Route15 0.127: AIN_S0T.P2 20.55,2.29 TET16.3
N$128
  Top 0.127: AIN_S0T.37 AIN_S0T.P37
  Route15 0.127: AIN_S0T.P37 arc36 TET24.3
N$199  (via drill 0.2 pad 0.3)
  Top 0.127: AIN_N0T.33 9.59,30.16 v8.91,26.68
  Route2 0.127: TET7.3 2.92,21.78 arc-21 v8.91,26.68
N$200  (via drill 0.2 pad 0.3)
  Top 0.127: AIN_N0T.32 9.95,30.35 v9.41,27.17
  Route15 0.127: TET7.2 2.99,22.46 arc-21 9.25,27.47 | 9.25,27.47 v9.41,27.17 | 9.25,27.47
N$201
  Top 0.127: AIN_N0T.31 10.27,30.56 AIN_N0T.P31
  Route2 0.127: TET7.1 3.11,23.12 arc-18 10.51,28.61 AIN_N0T.P31
N$202
  Top 0.127: AIN_N0T.30 10.61,30.79 AIN_N0T.P30
  Route15 0.127: TET7.0 3.26,23.81 arc-18 10.95,29.2 11.08,29.01 AIN_N0T.P30
N$203
  Top 0.127: AIN_N0T.29 10.92,31 AIN_N0T.P29
  Route2 0.127: TET6.3 3.43,24.51 arc-15 11.16,29.79 AIN_N0T.P29 11.33,29.54 11.21,29.72
N$204
  Top 0.127: AIN_N0T.28 11.27,31.21 AIN_N0T.P28
  Route15 0.127: TET6.2 3.64,25.18 arc-15 11.45,30.29 AIN_N0T.P28
N$205
  Top 0.127: AIN_N0T.27 11.61,31.44 AIN_N0T.P27
  Route2 0.127: TET6.1 3.83,25.82 arc-12 11.76,30.8 11.88,30.63 AIN_N0T.P27
N$206
  Top 0.127: AIN_N0T.26 11.95,31.66 AIN_N0T.P26
  Route15 0.127: TET6.0 4.1,26.48 arc-12 12.05,31.32 12.15,31.18 AIN_N0T.P26
N$207
  Top 0.127: AIN_N0T.25 AIN_N0T.P25
  Route2 0.127: TET5.3 4.39,27.16 arc-9 12.31,31.85 AIN_N0T.P25
N$208
  Top 0.127: AIN_N0T.24 AIN_N0T.P24
  Route15 0.127: TET5.2 4.68,27.8 arc-9 12.53,32.22 AIN_N0T.P24
N$209
  Top 0.127: AIN_N0T.P23 AIN_N0T.23
  Route2 0.127: TET5.1 5.01,28.37 arc-6 12.89,32.4 AIN_N0T.P23
N$210
  Top 0.127: AIN_N0T.22 AIN_N0T.P22
  Route15 0.127: TET5.0 5.37,28.99 arc-6 13.1,32.82 AIN_N0T.P22
N$211
  Top 0.127: AIN_N0T.P21 AIN_N0T.21
  Route2 0.127: TET4.3 5.75,29.58 arc-3 13.48,32.96 AIN_N0T.P21
N$212
  Top 0.127: AIN_N0T.20 AIN_N0T.P20
  Route15 0.127: TET4.2 6.16,30.16 arc-3 AIN_N0T.20 AIN_N0T.P20
N$213
  Top 0.127: AIN_N0T.P19 AIN_N0T.19
  Route2 0.127: TET4.1 6.56,30.68 14.08,33.51 AIN_N0T.P19
N$214
  Top 0.127: AIN_N0T.18 AIN_N0T.P18
  Route15 0.127: TET4.0 7.02,31.23 14.28,33.93 AIN_N0T.P18
N$215
  Top 0.127: AIN_N0T.P17 AIN_N0T.17
  Route2 0.127: TET3.3 7.5,31.77 arc3 14.68,34.05 AIN_N0T.P17
N$216
  Top 0.127: AIN_N0T.16 AIN_N0T.P16
  Route15 0.127: TET3.2 7.99,32.27 arc3 14.91,34.44 AIN_N0T.P16
N$217
  Top 0.127: AIN_N0T.P15 AIN_N0T.15
  Route2 0.127: TET3.1 8.48,32.73 arc6 15.28,34.59 AIN_N0T.P15
N$218
  Top 0.127: AIN_N0T.14 AIN_N0T.P14
  Route15 0.127: TET3.0 9.03,33.21 arc6 15.54,34.92 AIN_N0T.P14
N$219
  Top 0.127: AIN_N0T.P13 AIN_N0T.13
  Route2 0.127: AIN_N0T.P13 15.88,35.13 arc-9 9.61,33.65 TET2.3
N$220
  Top 0.127: AIN_N0T.12 AIN_N0T.P12
  Route15 0.127: TET2.2 10.17,34.07 arc9 16.19,35.39 AIN_N0T.P12
N$221
  Top 0.127: AIN_N0T.P11 AIN_N0T.11
  Route2 0.127: AIN_N0T.P11 16.48,35.68 arc-12 10.73,34.44 TET2.1
N$222
  Top 0.127: AIN_N0T.P10 AIN_N0T.10
  Route15 0.127: TET2.0 11.31,34.83 arc12 16.85,35.84 AIN_N0T.P10
N$223
  Top 0.127: AIN_N0T.9 AIN_N0T.P9
  Route2 0.127: AIN_N0T.P9 17.08,36.21 arc-15 11.95,35.16 TET1.3
N$224
  Top 0.127: AIN_N0T.P8 AIN_N0T.8
  Route15 0.127: AIN_N0T.P8 17.5,36.31 arc-15 12.58,35.49 TET1.2
N$225
  Top 0.127: AIN_N0T.P7 AIN_N0T.7
  Route2 0.127: AIN_N0T.P7 17.69,36.74 arc-18 13.17,35.75 TET1.1
N$226
  Top 0.127: AIN_N0T.6 AIN_N0T.P6
  Route15 0.127: AIN_N0T.P6 18.15,36.78 arc-18 13.83,36.03 TET1.0
N$227
  Top 0.127: AIN_N0T.5 AIN_N0T.P5
  Route2 0.127: AIN_N0T.P5 18.28,37.3 arc-21 14.54,36.28 TET0.3
N$228
  Top 0.127: AIN_N0T.P4 AIN_N0T.4
  Route15 0.127: AIN_N0T.P4 18.77,37.29 arc-21 15.18,36.6 TET0.2
N$229
  Top 0.127: AIN_N0T.P3 AIN_N0T.3
  Route2 0.127: AIN_N0T.P3 18.89,37.83 TET0.1
N$230
  Top 0.127: AIN_N0T.2 AIN_N0T.P2
  Route15 0.127: TET0.0 19.45,37.71 AIN_N0T.P2
N$231
  Top 0.127: AIN_N0T.38 AIN_N0T.P38
  Route2 0.127: TET8.1 3.01,17.54 arc28 AIN_N0T.P38
N$232
  Top 0.127: AIN_N0T.39 AIN_N0T.P39
  Route15 0.127: TET8.2 arc28 13,25.81 AIN_N0T.P39 arc-90 AIN_N0T.P39
N$233
  Top 0.127: AIN_N0T.40 AIN_N0T.P40
  Route2 0.127: TET8.3 3.24,16.21 arc24 13.32,26.05 AIN_N0T.P40
N$234
  Top 0.127: AIN_N0T.41 AIN_N0T.P41
  Route15 0.127: TET9.0 arc24 13.73,26.17 AIN_N0T.P41 arc90 AIN_N0T.P41
N$235
  Top 0.127: AIN_N0T.42 AIN_N0T.P42
  Route2 0.127: TET9.1 3.62,14.82 arc20 14.06,26.4 AIN_N0T.P42
N$236
  Top 0.127: AIN_N0T.43 AIN_N0T.P43
  Route15 0.127: TET9.2 arc20 14.41,26.58 AIN_N0T.P43 arc-90 AIN_N0T.P43
N$237
  Top 0.127: AIN_N0T.44 AIN_N0T.P44
  Route2 0.127: TET9.3 4.07,13.55 arc16 14.74,26.81 AIN_N0T.P44
N$238
  Top 0.127: AIN_N0T.45 AIN_N0T.P45
  Route15 0.127: TET10.0 arc16 15.1,27.01 15.09,27.01 AIN_N0T.P45
N$239
  Top 0.127: AIN_N0T.46 AIN_N0T.P46
  Route2 0.127: TET10.1 4.68,12.23 arc12 15.43,27.21 AIN_N0T.P46
N$240
  Top 0.127: AIN_N0T.47 AIN_N0T.P47
  Route15 0.127: TET10.2 arc12 15.78,27.42 AIN_N0T.P47 arc90 AIN_N0T.P47
N$241
  Top 0.127: AIN_N0T.48 AIN_N0T.P48
  Route2 0.127: TET10.3 5.34,11.01 arc8 16.11,27.64 AIN_N0T.P48
N$242
  Top 0.127: AIN_N0T.49 AIN_N0T.P49
  Route15 0.127: TET11.0 arc8 16.47,27.82 AIN_N0T.P49 | AIN_N0T.P49 arc90 AIN_N0T.P49
N$243
  Top 0.127: AIN_N0T.50 AIN_N0T.P50
  Route2 0.127: TET11.1 6.16,9.81 arc4 16.77,28.08 AIN_N0T.P50
N$244
  Top 0.127: AIN_N0T.51 AIN_N0T.P51
  Route15 0.127: TET11.2 arc4 17.13,28.28 AIN_N0T.P51 arc90 AIN_N0T.P51
N$245
  Top 0.127: AIN_N0T.52 AIN_N0T.P52
  Route2 0.127: TET11.3 6.87,8.65 17.46,28.51 AIN_N0T.P52
N$246
  Top 0.127: AIN_N0T.53 AIN_N0T.P53
  Route15 0.127: TET12.0 17.82,28.69 AIN_N0T.P53 arc-90 AIN_N0T.P53
N$247
  Top 0.127: AIN_N0T.54 AIN_N0T.P54
  Route2 0.127: TET12.1 7.86,7.58 arc-4 18.15,28.91 AIN_N0T.P54
N$248
  Top 0.127: AIN_N0T.55 AIN_N0T.P55
  Route15 0.127: TET12.2 arc-4 18.48,29.14 AIN_N0T.P55 arc90 AIN_N0T.P55
N$249
  Top 0.127: AIN_N0T.56 AIN_N0T.P56
  Route2 0.127: TET12.3 8.88,6.66 arc-8 18.81,29.37 AIN_N0T.P56
N$250
  Top 0.127: AIN_N0T.P57 17.84,31.53 AIN_N0T.57
  Route15 0.127: TET13.0 arc-8 19.14,29.6 17.9,31.43 arc90 AIN_N0T.P57
N$251
  Top 0.127: AIN_N0T.58 AIN_N0T.P58
  Route2 0.127: TET13.1 10.04,5.78 arc-12 19.47,29.83 AIN_N0T.P58
N$252
  Top 0.127: AIN_N0T.59 AIN_N0T.P59
  Route15 0.127: TET13.2 arc-12 19.8,30.03 AIN_N0T.P59 arc-90 AIN_N0T.P59
N$253
  Top 0.127: AIN_N0T.60 AIN_N0T.P60
  Route2 0.127: TET13.3 11.21,5.04 arc-16 20.13,30.26 AIN_N0T.P60
N$254
  Top 0.127: AIN_N0T.61 AIN_N0T.P61
  Route15 0.127: TET14.0 arc-16 20.46,30.49 AIN_N0T.P61 arc-90 AIN_N0T.P61
N$255
  Top 0.127: AIN_N0T.62 AIN_N0T.P62
  Route2 0.127: TET14.1 12.48,4.35 arc-20 20.79,30.72 AIN_N0T.P62
N$256
  Top 0.127: AIN_N0T.63 AIN_N0T.P63
  Route15 0.127: TET14.2 arc-20 21.12,30.95 AIN_N0T.P63
N$257
  Top 0.127: AIN_N0T.64 AIN_N0T.P64
  Route2 0.127: TET14.3 13.73,3.8 arc-24 21.45,31.18 AIN_N0T.P64
N$258  (via drill 0.2 pad 0.3)
  Top 0.127: AIN_N0T.65 20.15,33.81 20.95,32.7 arc30 v21.55,31.74
  Route15 0.127: TET15.0 arc-24 21.78,31.41 v21.55,31.74 arc90 v21.55,31.74
N$259  (via drill 0.2, 0.2 pad 0.3)
  Top 0.127: AIN_N0T.66 20.9,33.41 v20.96,33.4
  Route2 0.127: TET15.1 15.12,3.34 arc-28 v22.14,31.58
  Bottom 0.127: v20.96,33.4 21.48,33.76 arc-180 22.69,31.95 v22.14,31.58
N$260  (via drill 0.2 pad 0.3)
  Top 0.127: 20.8,34.26 AIN_N0T.67 20.79,34.27 20.4,34.85 v20.22,34.89
  Route15 0.127: TET15.2 arc-28 22.27,31.16 22.9,31.64 arc180 21.49,33.78 21.43,33.74 21.11,33.8 20.4,34.85 v20.22,34.89 20.4,34.85
N$261  (via drill 0.2 pad 0.3)
  Top 0.127: AIN_N0T.68 21.58,33.84 21.57,33.84 arc-180 23.28,31.37 v22.63,30.93
  Route2 0.127: TET15.3 16.47,3.01 arc-32 v22.63,30.93
N$1000
  Top 0.127: AIN_N0T.37 AIN_N0T.P37
  Route15 0.127: TET8.0 arc-36 AIN_N0T.P37
REF_A0
  Top 0.254: AIN_N0T.1 19.15,38.87 REF_A0.P$1
REF_A1  (via drill 0.25)
  Top 0.254: v6.88,24.02 7.51,24.44 8.92,24.17 10.81,25.45 11.03,26.58 AIN_N0T.36
  Bottom 0.254: REF_A1.P$1 5.33,22.67 5.4,23.02 v6.88,24.02
REF_B0
  Top 0.254: AIN_S0T.1 20.85,1.13 REF_B0.P$1
REF_B1  (via drill 0.25)
  Top 0.254: v31.39,15.62 29.32,14.23 29.12,13.19 AIN_S0T.36
  Bottom 0.254: REF_B1.P$1 37.84,19.98 35.95,18.7 35.89,18.35 31.74,15.56 v31.39,15.62

### Text on the board
tPlace: R | S | A | A-S-G | G-S-A | 34° | S | A | R | R | A | S | A-S-G | G-S-A | A | S | R
bPlace: 128 Channel EIB | Rev. 1.0 / CC BY-SA-NC-4.0 / JPN, MWL@MIT / 2015-02